# Altium schematic sheet I2C.SchDoc
size A4
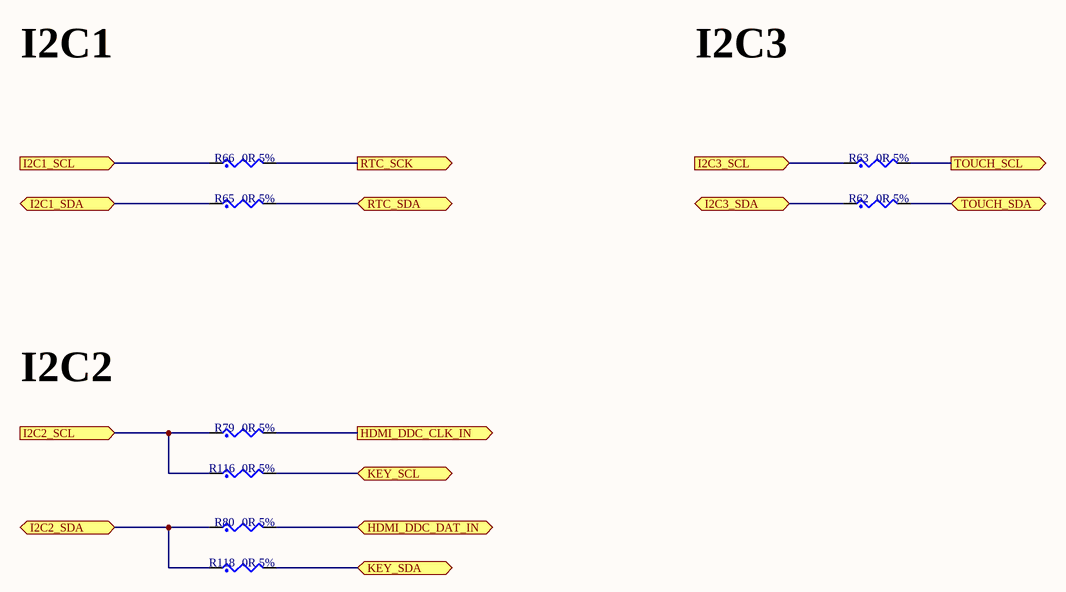
[diagram p0: I2C.SchDoc]

## Parts
R62  0R 5%  [SR0603]
R63  0R 5%  [SR0603]
R65  0R 5%  [SR0603]
R66  0R 5%  [SR0603]
R79  0R 5%  [SR0603]
R80  0R 5%  [SR0603]
R116  0R 5%  [SR0603]
R118  0R 5%  [SR0603]

## Ports
HDMI_DDC_CLK_IN (out), HDMI_DDC_DAT_IN (bidir), I2C1_SCL (in), I2C1_SDA (bidir), I2C2_SCL (in), I2C2_SDA (bidir), I2C3_SCL (in), I2C3_SDA (bidir), KEY_SCL (bidir), KEY_SDA (bidir), RTC_SCK (out), RTC_SDA (bidir), TOUCH_SCL (out), TOUCH_SDA (bidir)

## Nets
HDMI_DDC_CLK_IN: R79.2 ; port HDMI_DDC_CLK_IN
HDMI_DDC_DAT_IN: R80.2 ; port HDMI_DDC_DAT_IN
I2C1_SCL: R66.1 ; port I2C1_SCL
I2C1_SDA: R65.1 ; port I2C1_SDA
I2C2_SCL: R79.1 R116.1 ; port I2C2_SCL
I2C2_SDA: R80.1 R118.1 ; port I2C2_SDA
I2C3_SCL: R63.1 ; port I2C3_SCL
I2C3_SDA: R62.1 ; port I2C3_SDA
KEY_SCL: R116.2 ; port KEY_SCL
KEY_SDA: R118.2 ; port KEY_SDA
RTC_SCK: R66.2 ; port RTC_SCK
RTC_SDA: R65.2 ; port RTC_SDA
TOUCH_SCL: R63.2 ; port TOUCH_SCL
TOUCH_SDA: R62.2 ; port TOUCH_SDA

## Notes on the sheet
- I2C1
- I2C3
- I2C2

## Library data of the parts
R62 R63 R65 R66 R79 R80 R116 R118 = RES: CLASS: DISCRETE